# EAGLE design CMoy-Pro-V_0_0_1A (EAGLE 6.4)
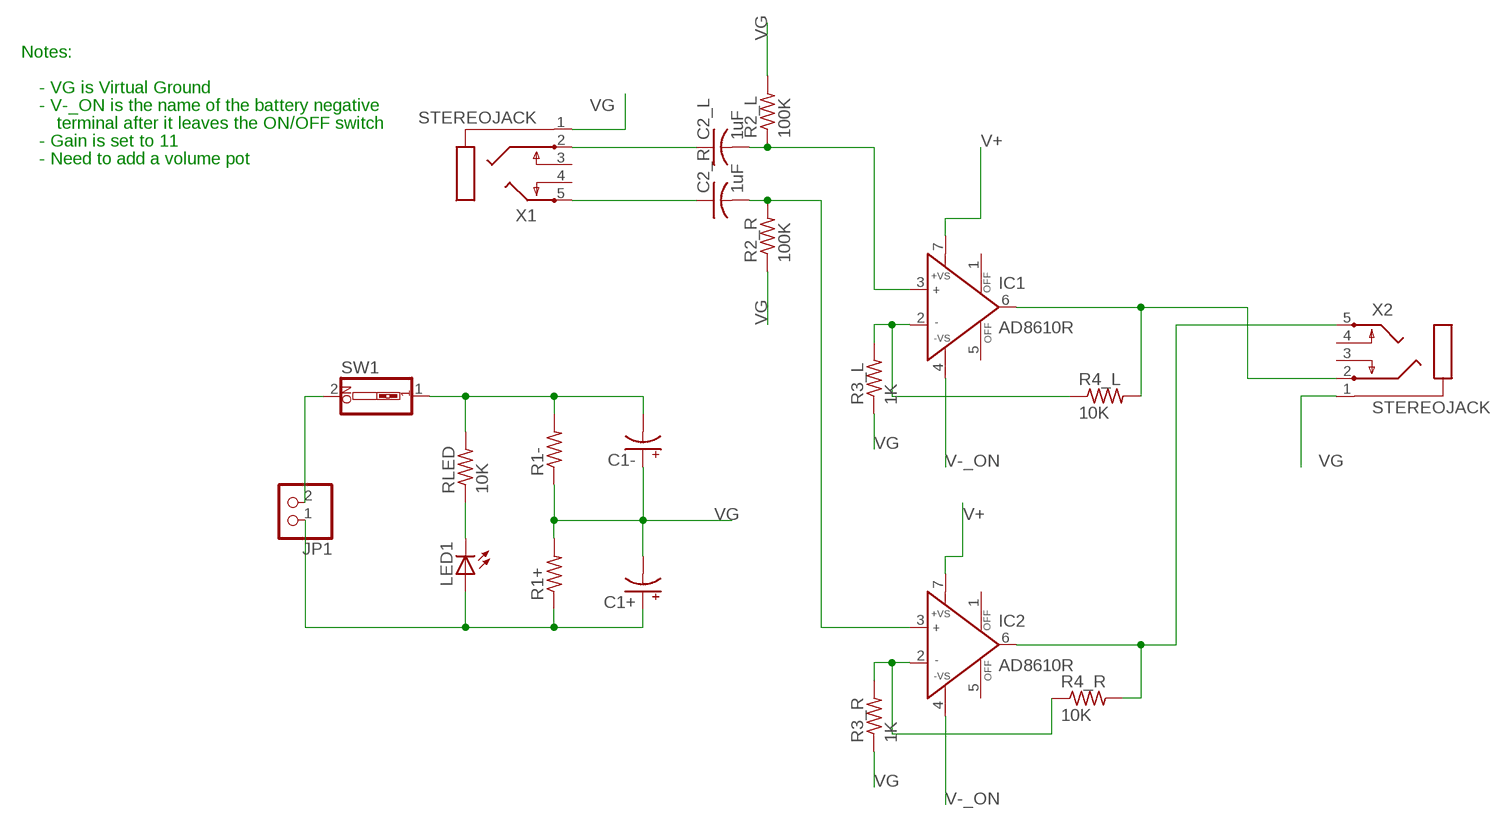
[diagram p0: schematic, sheet 1]

## Parts
C1+  CPOL-USE2.5-6  [E2,5-6]
C1-  CPOL-USE2.5-6  [E2,5-6]
C2_L  1uF  C-US102-043X133  [C102-043X133]
C2_R  1uF  C-US102-043X133  [C102-043X133]
IC1  AD8610R  [SO8]
IC2  AD8610R  [SO8]
JP1  PINHD-1X2  [1X02]
LED1  LED3MM  [LED3MM]
R1+  R-US_0207/7  [0207/7]
R1-  R-US_0207/7  [0207/7]
R2_L  100K  R-US_0207/7  [0207/7]
R2_R  100K  R-US_0207/7  [0207/7]
R3_L  1K  R-US_0207/7  [0207/7]
R3_R  1K  R-US_0207/7  [0207/7]
R4_L  10K  R-US_0207/7  [0207/7]
R4_R  10K  R-US_0207/7  [0207/7]
RLED  10K  R-US_0207/7  [0207/7]
SW1  SW_DIP-1  [EDG-01]
X1  STEREOJACK  [STX3100]
X2  STEREOJACK  [STX3100]

## Nets
IN_L: C2_L.1 X1.2
IN_R: C2_R.1 X1.5
N$3: LED1.K(C) RLED.1
N$4: C2_L.2 IC1.3(IN+) R2_L.1
N$5: IC1.2(IN-) R3_L.2 R4_L.1
N$6: IC2.2(IN-) R3_R.2 R4_R.1
N$7: C2_R.2 IC2.3(IN+) R2_R.2
OUT_L: IC1.6(OUT) R4_L.2 X2.2
OUT_R: IC2.6(OUT) R4_R.2 X2.5
V+: C1+.+ IC1.7(+VS) IC2.7(+VS) JP1.1 LED1.A R1+.1
V-: JP1.2 SW1.2
V-_ON: C1-.- IC1.4(-VS) IC2.4(-VS) R1-.2 RLED.2 SW1.1
VG: C1+.- C1-.+ R1+.2 R1-.1 R2_L.2 R2_R.1 R3_L.1 R3_R.1 X1.1 X2.1
Unconnected: IC1.1(OFF) IC1.5(OFF) IC2.1(OFF) IC2.5(OFF) X1.3 X1.4 X2.3 X2.4

## Notes on the sheet
- Notes:
- - VG is Virtual Ground
- - V-_ON is the name of the battery negative
- terminal after it leaves the ON/OFF switch
- - Gain is set to 11
- - Need to add a volume pot

## Library data of the parts
C1+ C1- = rcl:CPOL-US: POLARIZED CAPACITOR, American symbol
C2_L C2_R = rcl:C-US: CAPACITOR, American symbol
IC1 IC2 = analog-devices:AD8610: Precision, Very Low Noise, Low Input Bias Current, Wide Bandwidth JFET Operational Amplifiers Source: http://www.analog.com/static/imported-files/data_sheets/AD8610_8620.pdf; MF: ALTERA CORPORATION; MPN: AD8610BRZ; OC_FARNELL: 8621578; OC_NEWARK: 59K6944
JP1 = pinhead:PINHD-1X2: PIN HEADER
LED1 = adafruit:LED: LED OSRAM: - CHIPLED LG R971, LG N971, LY N971, LG Q971, LY Q971, LO R971, LY R971 LH N974, LH R974 LS Q976, LO Q976, LY Q976 LO Q996 - Hyper CHIPLED LW Q18S LB Q993, LB Q99A, LB R99A - SideLED LS A670, LO A670, LY A670, LG A670, LP A670 LB A673, LV A673, LT A673, LW A673 LH A674 LY A675 LS A676, LA A676, LO A676, LY A676, LW A676 LS A679, LY A679, LG A679 - Hyper Micro SIDELED® LS Y876, LA Y876, LO Y876, LY Y876 LT Y87S - SmartLED LW L88C, LW L88S LB L89C, LB L89S, LG L890 LS L89K, LO L89K, LY L89K LS L896, LA L896, LO L896, LY L896 - TOPLED LS T670, LO T670, LY T670, LG T670, LP T670 LSG T670, LSP T670, LSY T670, LOP T670, LYG T670 LG T671, LOG T671, LSG T671 LB T673, LV T673, LT T673, LW T673 LH T674 LS T676, LA T676, LO T676, LY T676, LB T676, LH T676, LSB T676, LW T676 LB T67C, LV T67C, LT T67C, LS T67K, LO T67K, LY T67K, LW E67C LS E67B, LA E67B, LO E67B, LY E67B, LB E67C, LV E67C, LT E67C LW T67C LS T679, LY T679, LG T679 LS T770, LO T770, LY T770, LG T770, LP T770 LB T773, LV T773, LT T773, LW T773 LH T774 LS E675, LA E675, LY E675, LS T675 LS T776, LA T776, LO T776, LY T776, LB T776 LHGB T686 LT T68C, LB T68C - Hyper Mini TOPLED® LB M676 - Mini TOPLED Santana® LG M470 LS M47K, LO M47K, LY M47K Source: http://www.osram.convergy.de/
R1+ R1- R2_L R2_R R3_L R3_R R4_L R4_R RLED = rcl:R-US_: RESISTOR, American symbol
SW1 = special:SW_DIP-1: DIP SWITCH
X1 X2 = adafruit:STEREOJACK: MIC/HEADPHONE JACK Stereo jack with two switches. Kycon STX3100, CUI SJ1-3555NG and/or 4UCon 05544

## Board
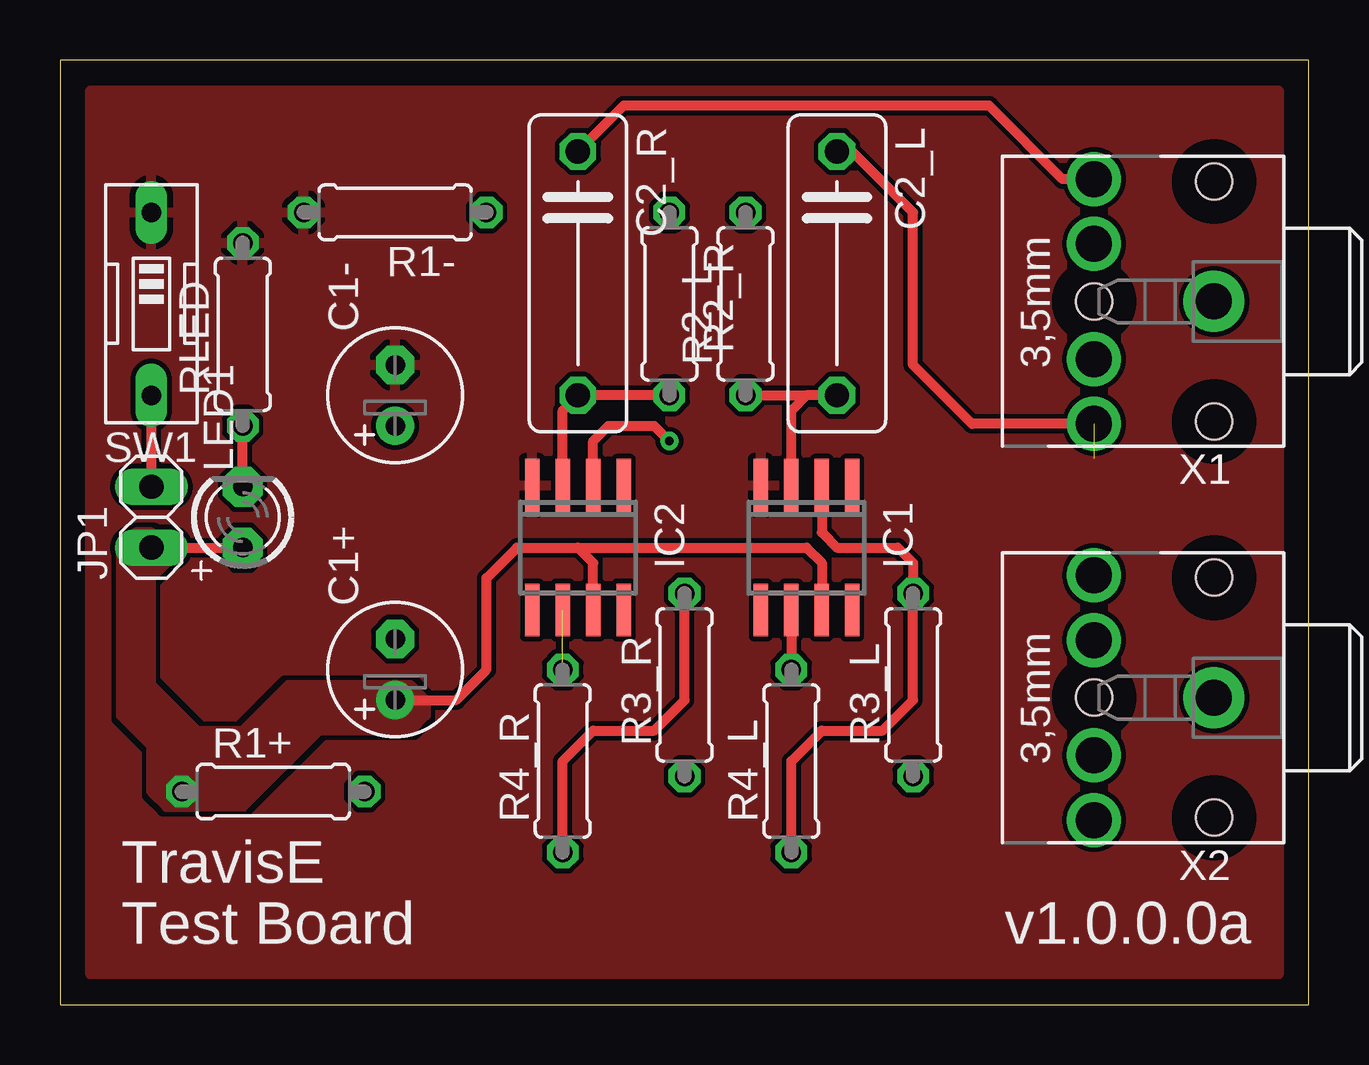
[diagram p1: board, top side]
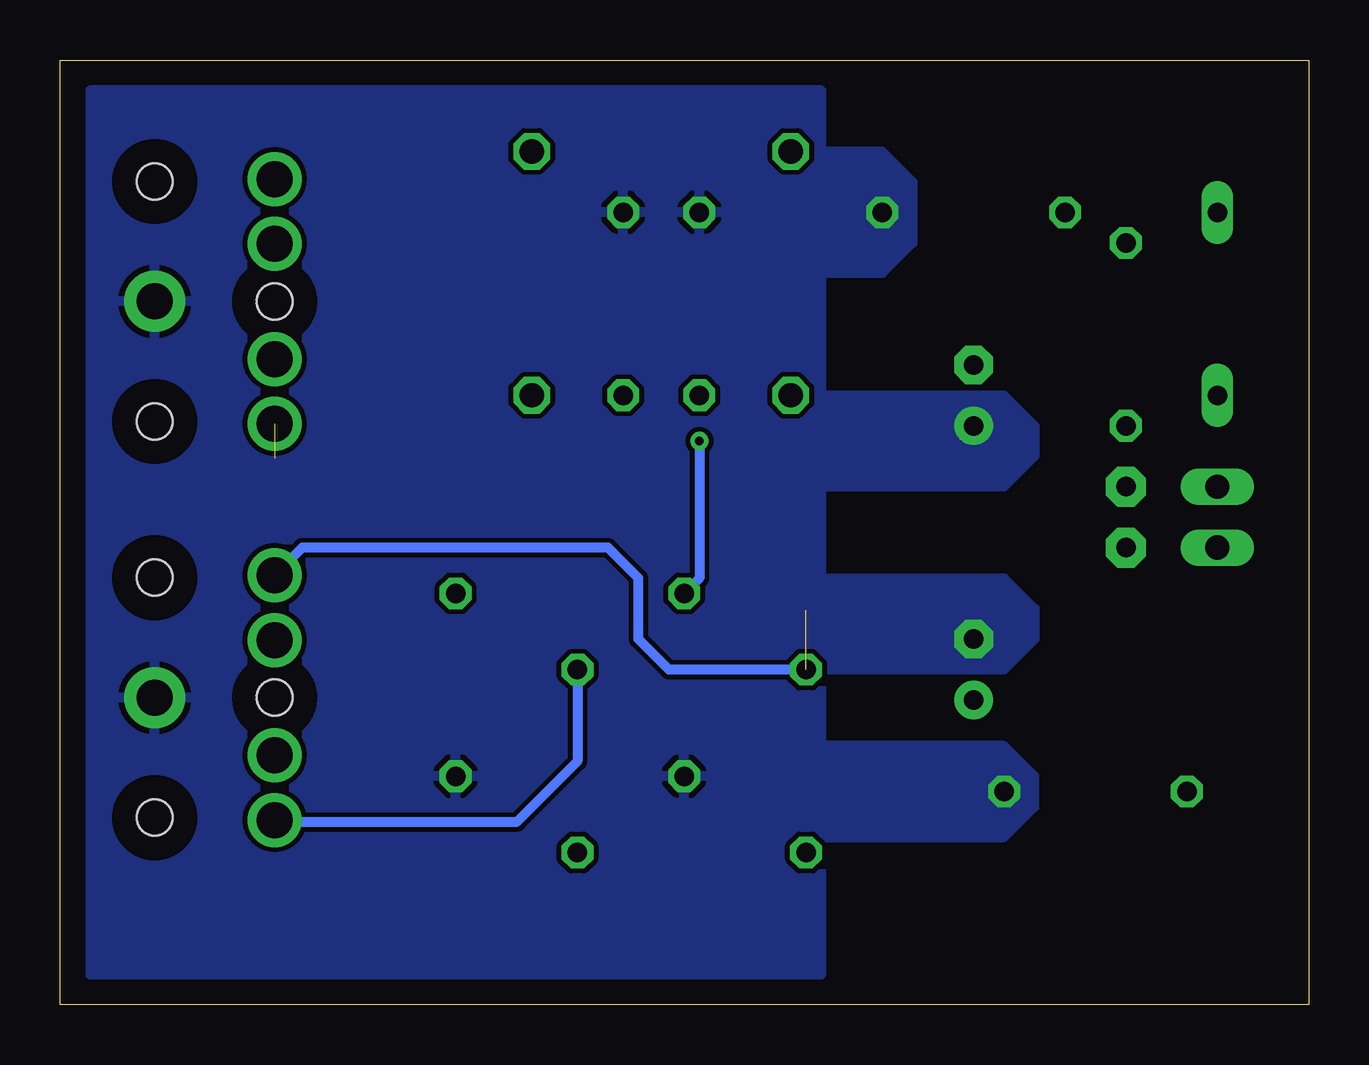
[diagram p2: board, bottom side, seen from below]

Size 52.05 x 39.37 mm. Coordinates in mm from the lower left corner, seen from the top.
Outline: 0,0 52.05,0 52.05,39.37 0,39.37 0,0
Copper layers (1*16): Top 0.035mm / dielectric 1.5mm / Bottom 0.035mm
Design rules "default": minimum track width 10mil, minimum drill 24mil, track to track 8mil, track to pad 8mil, pad to pad 8mil, via to via 8mil, smd to smd 8mil, copper to edge 40mil, drill to drill 8mil, minimum pad ring 10mil, minimum via ring 8mil, stop-mask expansion 4mil, vias tented up to drill 0mil, thermal gap 10mil

### Footprints (pad centres in the part's own frame; a part is rotated, then mirrored left to right if it is on the bottom)
E2,5-6 = drill 0.813 pad 1.6: + -1.27,0 | drill 0.813 pad 1.6 octagon: - 1.27,0
C102-043X133 = drill 1.016 octagon: 1 -5.08,0; 2 5.08,0
SO8 = smd 0.6 x 2.2: 1 -1.905,-2.6; 2 -0.635,-2.6; 3 0.635,-2.6; 4 1.905,-2.6; 5 1.905,2.6; 6 0.635,2.6; 7 -0.635,2.6; 8 -1.905,2.6
1X02 = drill 1.016 long: 1 -1.27,0; 2 1.27,0
LED3MM = drill 0.813 pad 1.676 octagon: A -1.27,0; K 1.27,0
0207/7 = drill 0.813 octagon: 1 -3.81,0; 2 3.81,0
EDG-01 = drill 0.813 long: 1 0,-3.81; 2 0,3.81
STX3100 = drill 1.5 pad 2.54: 1 2.7,-0.1 | drill 1.5: 2 7.7,5; 3 7.7,2.3; 4 7.7,-2.5; 5 7.7,-5.2 | hole 1.5: 2.7,4.9; 2.7,-5.1; 7.7,-0.1

### Placement (x,y rotation side)
C1+  13.97,13.97 90 top
C1-  13.97,25.4 90 top
C2_L  32.39,30.48 270 top
C2_R  21.59,30.48 270 top
IC1  31.11,19.05 180 top
IC2  21.59,19.05 180 top
JP1  3.81,20.32 90 top
LED1  7.62,20.32 90 top
R1+  8.89,8.89 0 top
R1-  13.97,33.02 180 top
R2_L  28.58,29.21 90 top
R2_R  25.4,29.21 270 top
R3_L  35.56,13.34 90 top
R3_R  26.03,13.34 90 top
R4_L  30.48,10.16 90 top
R4_R  20.95,10.16 90 top
RLED  7.62,27.94 90 top
SW1  3.81,29.21 180 top
X1  50.8,29.21 180 top
X2  50.8,12.7 180 top

### Tracks (layer width: path | path; a pad name or v marks a point on that pad's centre or on a via)
IN_L  (1 unrouted)
  Top 0.406: X1.2 38.02,24.21 35.56,26.67 35.56,33.02 33.02,35.56 C2_L.1
IN_R
  Top 0.406: X1.5 41.79,34.41 38.74,37.46 23.5,37.46 C2_R.1
N$3
  Top 0.406: LED1.K RLED.1
N$4
  Top 0.406: IC1.3 30.48,24.77 31.11,25.4 | C2_L.2 31.75,25.4 31.11,25.4 | R2_L.1 31.11,25.4
N$5
  Top 0.406: IC1.2 31.75,19.69 32.39,19.05 34.93,19.05 35.56,18.41 R3_L.2 35.56,12.7 34.29,11.43 31.75,11.43 30.48,10.16 R4_L.1
N$6  (via drill 0.35)
  Top 0.406: IC2.2 22.22,23.49 22.86,24.13 24.77,24.13 v25.4,23.49 | R4_R.1 20.95,10.16 22.22,11.43 24.77,11.43 26.03,12.7 R3_R.2
  Bottom 0.406: v25.4,23.49 25.4,17.78 R3_R.2
N$7
  Top 0.406: IC2.3 20.95,24.77 C2_R.2 R2_R.2
OUT_L
  Top 0.406: IC1.6 R4_L.2
  Bottom 0.406: R4_L.2 30.48,10.16 33.02,7.62 43.18,7.62 X2.2
OUT_R  (1 unrouted)
  Bottom 0.406: R4_R.2 26.67,13.97 27.94,15.24 27.94,17.78 29.21,19.05 41.95,19.05 X2.5
V+
  Top 0.406: JP1.1 LED1.A | C1+.+ 16.51,12.7 17.78,13.97 17.78,17.78 19.05,19.05 21.59,19.05 | 21.59,19.05 31.11,19.05 31.75,18.41 IC1.7 | IC2.7 22.22,18.41 21.59,19.05
  pour Top (rank 5, no thermals): 3.81,19.69 3.17,19.69 2.54,19.05 2.54,12.07 3.81,10.8 3.81,8.89 4.44,8.26 5.72,8.26 6.35,8.89 6.35,9.52 5.72,10.16 5.72,11.43 3.81,13.34 3.81,17.78 4.44,18.41 4.44,19.05
  pour Top (no thermals): 15.24,12.07 14.61,11.43 10.8,11.43 7.62,8.26 5.72,8.26 5.72,11.43 7.62,11.43 9.53,13.34 14.61,13.34 15.24,12.7
V-
  Top 0.406: SW1.2 JP1.2
V-_ON
  pour Top (rank 6): 1.27,38.1 50.8,38.1 50.8,1.27 1.27,1.27
VG
  pour Bottom: 20.32,38.1 50.8,38.1 50.8,1.27 20.32,1.27
  pour Bottom (no thermals): 16.51,34.29 16.51,31.75 17.78,30.48 21.59,30.48 21.59,34.29 20.32,35.56 17.78,35.56
  pour Bottom (no thermals): 11.43,9.52 12.7,10.8 20.95,10.8 21.59,10.16 21.59,7.62 20.95,6.99 12.7,6.99 11.43,8.26 11.43,8.89
  pour Bottom (no thermals): 12.7,25.4 11.43,24.13 11.43,22.86 12.7,21.59 20.95,21.59 20.95,25.4
  pour Bottom (no thermals): 12.7,17.78 11.43,16.51 11.43,15.24 12.7,13.97 20.95,13.97 20.95,17.78

### Text on the board
tPlace: TravisE | Test Board | v1.0.0.0a